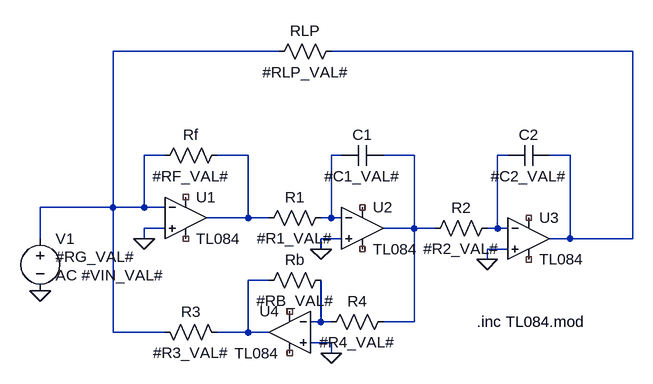
[diagram p0: schematic simulacion_celda.asc]
simulacion_celda.asc, the LTspice schematic file:
Version 4
SHEET 1 880 680
WIRE 256 -208 0 -208
WIRE 800 -208 336 -208
WIRE 80 -48 48 -48
WIRE 208 -48 160 -48
WIRE 352 -48 336 -48
WIRE 464 -48 416 -48
WIRE 608 -48 592 -48
WIRE 704 -48 672 -48
WIRE 0 32 0 -208
WIRE 0 32 -112 32
WIRE 48 32 48 -48
WIRE 48 32 0 32
WIRE 80 32 48 32
WIRE 208 48 208 -48
WIRE 208 48 144 48
WIRE 240 48 208 48
WIRE 336 48 336 -48
WIRE 336 48 320 48
WIRE 352 48 336 48
WIRE 80 64 48 64
WIRE 464 64 464 -48
WIRE 464 64 416 64
WIRE 496 64 464 64
WIRE 592 64 592 -48
WIRE 592 64 576 64
WIRE 608 64 592 64
WIRE -112 80 -112 32
WIRE 48 80 48 64
WIRE 352 80 320 80
WIRE 704 80 704 -48
WIRE 704 80 672 80
WIRE 800 80 800 -208
WIRE 800 80 704 80
WIRE 320 96 320 80
WIRE 608 96 576 96
WIRE 576 112 576 96
WIRE 240 144 208 144
WIRE 320 208 320 144
WIRE 320 208 304 208
WIRE 336 208 320 208
WIRE 464 208 464 64
WIRE 464 208 416 208
WIRE 0 224 0 32
WIRE 80 224 0 224
WIRE 208 224 208 144
WIRE 208 224 160 224
WIRE 240 224 208 224
WIRE 336 240 304 240
WIRE 336 256 336 240
FLAG 48 80 0
FLAG 320 96 0
FLAG 576 112 0
FLAG 336 256 0
FLAG -112 160 0
SYMBOL voltage -112 64 R0
WINDOW 3 24 44 Left 2
WINDOW 123 24 72 Left 2
WINDOW 39 0 0 Left 2
SYMATTR InstName V1
SYMATTR Value #RG_VAL#
SYMATTR Value2 AC #VIN_VAL#
SYMBOL Opamps\\opamp2 112 -16 R0
SYMATTR InstName U1
SYMATTR Value TL084
SYMBOL Opamps\\opamp2 384 0 R0
SYMATTR InstName U2
SYMATTR Value TL084
SYMBOL Opamps\\opamp2 640 16 R0
SYMATTR InstName U3
SYMATTR Value TL084
SYMBOL Opamps\\opamp2 272 160 M0
SYMATTR InstName U4
SYMATTR Value TL084
SYMBOL res 176 -64 R90
WINDOW 0 0 56 VBottom 2
WINDOW 3 32 56 VTop 2
SYMATTR InstName Rf
SYMATTR Value #RF_VAL#
SYMBOL res 336 32 R90
WINDOW 0 0 56 VBottom 2
WINDOW 3 32 56 VTop 2
SYMATTR InstName R1
SYMATTR Value #R1_VAL#
SYMBOL cap 416 -64 R90
WINDOW 0 0 32 VBottom 2
WINDOW 3 32 32 VTop 2
SYMATTR InstName C1
SYMATTR Value #C1_VAL#
SYMBOL res 592 48 R90
WINDOW 0 0 56 VBottom 2
WINDOW 3 32 56 VTop 2
SYMATTR InstName R2
SYMATTR Value #R2_VAL#
SYMBOL cap 672 -64 R90
WINDOW 0 0 32 VBottom 2
WINDOW 3 32 32 VTop 2
SYMATTR InstName C2
SYMATTR Value #C2_VAL#
SYMBOL res 432 192 R90
WINDOW 0 0 56 VBottom 2
WINDOW 3 32 56 VTop 2
SYMATTR InstName R4
SYMATTR Value #R4_VAL#
SYMBOL res 336 128 R90
WINDOW 0 0 56 VBottom 2
WINDOW 3 32 56 VTop 2
SYMATTR InstName Rb
SYMATTR Value #RB_VAL#
SYMBOL res 64 208 M90
WINDOW 0 0 56 VBottom 2
WINDOW 3 32 56 VTop 2
SYMATTR InstName R3
SYMATTR Value #R3_VAL#
SYMBOL res 352 -224 R90
WINDOW 0 0 56 VBottom 2
WINDOW 3 32 56 VTop 2
SYMATTR InstName RLP
SYMATTR Value #RLP_VAL#
TEXT 560 208 Left 2 !.inc TL084.mod

The netlist it stands for:
* simulacion_celda.asc
V1 N001 0 #RG_VAL# AC #VIN_VAL#
XU1 0 N001 NC_01 NC_02 N003 TL084  ; pins In+ In- V+ V- OUT
XU2 0 N004 NC_03 NC_04 N005 TL084  ; pins In+ In- V+ V- OUT
XU3 0 N006 NC_05 NC_06 N002 TL084  ; pins In+ In- V+ V- OUT
XU4 0 N008 NC_07 NC_08 N007 TL084  ; pins In+ In- V+ V- OUT
Rf N003 N001 #RF_VAL#
R1 N004 N003 #R1_VAL#
C1 N005 N004 #C1_VAL#
R2 N006 N005 #R2_VAL#
C2 N002 N006 #C2_VAL#
R4 N005 N008 #R4_VAL#
Rb N008 N007 #RB_VAL#
R3 N001 N007 #R3_VAL#
RLP N002 N001 #RLP_VAL#
.inc TL084.mod
.backanno
.end